# EAGLE schematic OLED (EAGLE 7.1.0)
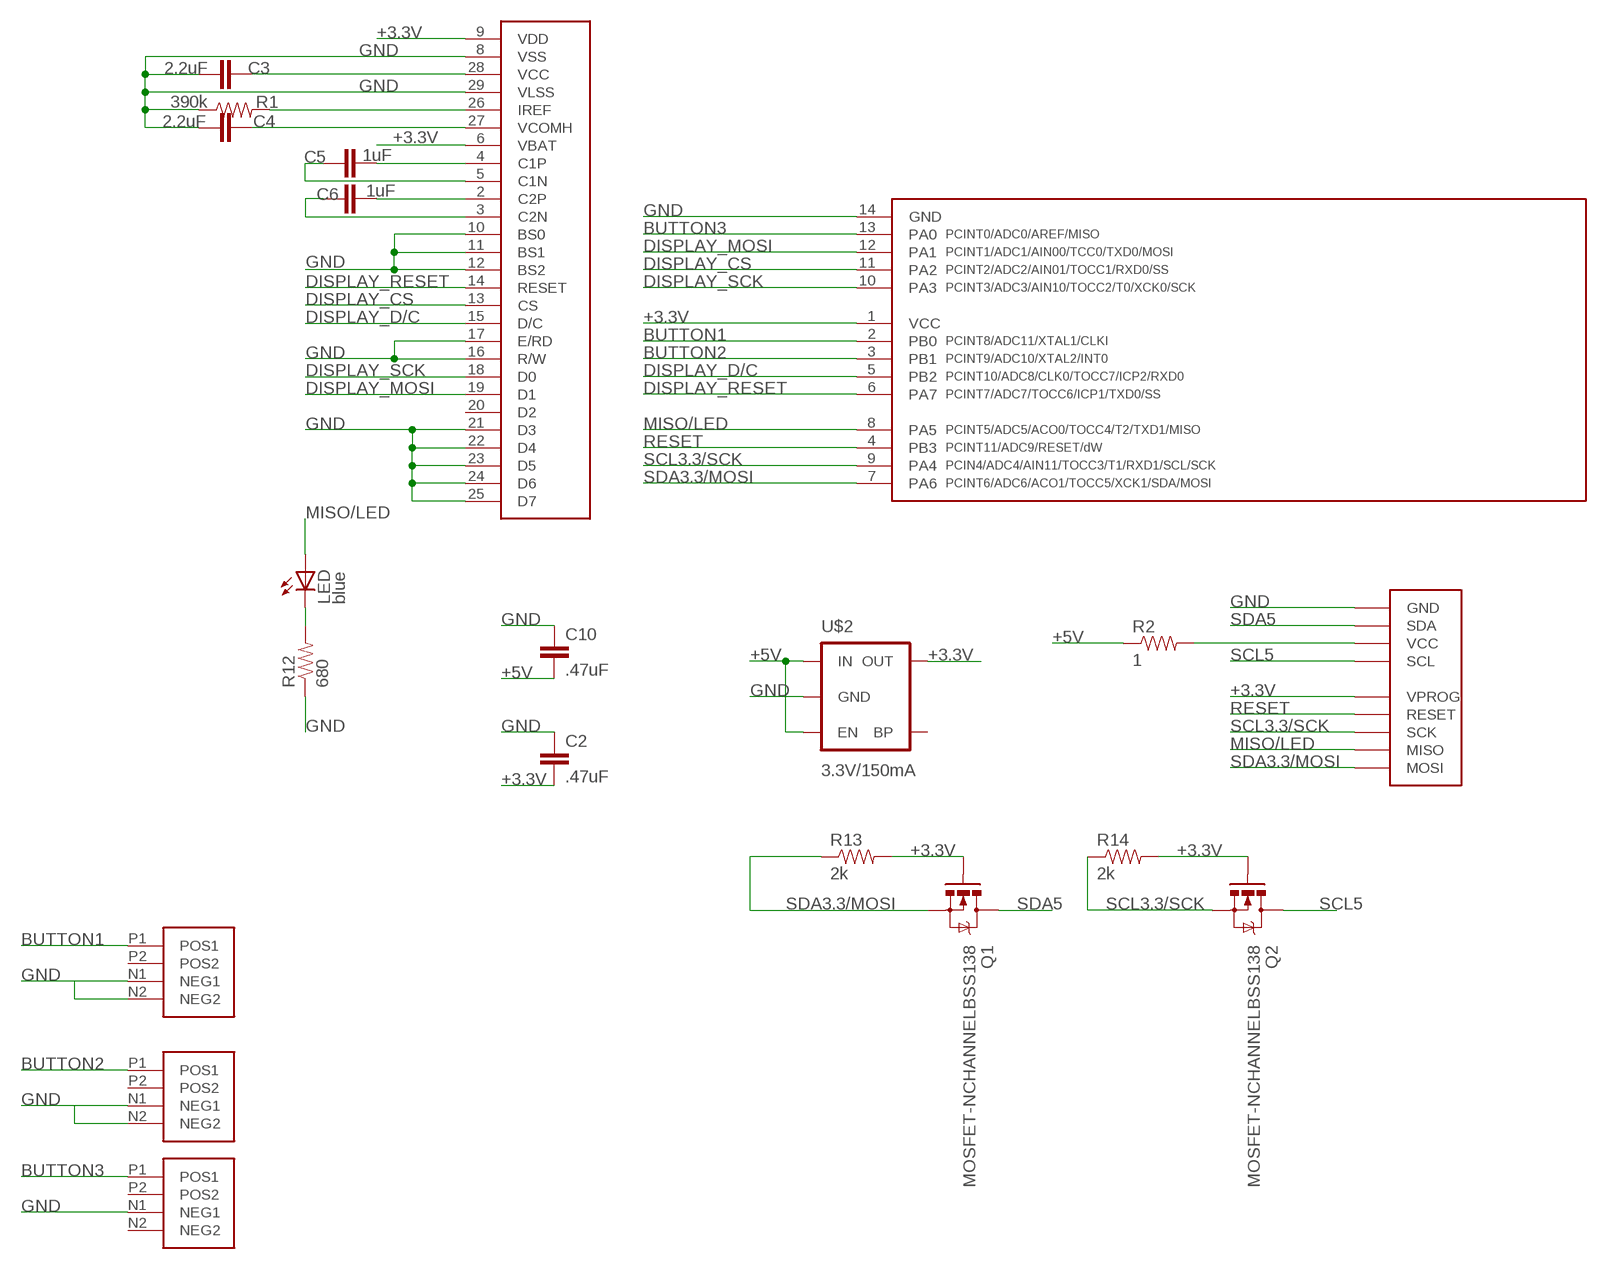
[diagram p0: schematic, sheet 1]

## Parts
C2  .47uF  CAP0805  [0805]
C3  2.2uF  CAP0805  [0805]
C4  2.2uF  CAP0805  [0805]
C5  1uF  CAP0805  [0805]
C6  1uF  CAP0805  [0805]
C10  .47uF  CAP0805  [0805]
LED  blue  LEDCHIPLED_1206  [CHIPLED_1206]
Q1  MOSFET-NCHANNELBSS138  [SOT23]
Q2  MOSFET-NCHANNELBSS138  [SOT23]
R1  390k  RESISTOR0603  [0603-RES]
R2  1  RESISTOR0805-RES  [0805]
R12  680  RESISTOR0805-RES  [0805]
R13  2k  RESISTOR0805-RES  [0805]
R14  2k  RESISTOR0805-RES  [0805]
U$1  OLEDREVERSE  [FPC-30-REVERSE]
U$2  3.3V/150mA  V_REG_MIC52053.3V  [SOT23-5]
U$3  TINY841  [SOIC14]
U$4  FOOTPRINTFOOTPRINT-2  [FOOTPRINT2]
U$5  TACT-SWITCHKMR2  [TACT-SWITCH-SMALL]
U$6  TACT-SWITCHKMR2  [TACT-SWITCH-SMALL]
U$7  TACT-SWITCHKMR2  [TACT-SWITCH-SMALL]

## Nets
+3.3V: C2.2 Q1.1(G) Q2.1(G) R13.2 R14.2 U$1.6(VBAT) U$1.9(VDD) U$2.5(OUT) U$3.1(VCC) U$4.PROG0(VPROG)
+5V: C10.2 R2.1 U$2.1(IN) U$2.3(EN)
BUTTON1: U$3.2(PB0) U$5.P1(POS1)
BUTTON2: U$3.3(PB1) U$6.P1(POS1)
BUTTON3: U$3.13(PA0) U$7.P1(POS1)
DISPLAY_CS: U$1.13(CS) U$3.11(PA2)
DISPLAY_D/C: U$1.15(D/C) U$3.5(PB2)
DISPLAY_MOSI: U$1.19(D1) U$3.12(PA1)
DISPLAY_RESET: U$1.14(RESET) U$3.6(PA7)
DISPLAY_SCK: U$1.18(D0) U$3.10(PA3)
GND: C2.1 C3.2 C4.2 C10.1 R1.1 R12.1 U$1.8(VSS) U$1.10(BS0) U$1.11(BS1) U$1.12(BS2) U$1.16(R/W) U$1.17(E/RD) U$1.21(D3) U$1.22(D4) U$1.23(D5) U$1.24(D6) U$1.25(D7) U$1.29(VLSS) U$2.2(GND) U$3.14(GND) U$4.BUS0(GND) U$5.N1(NEG1) U$5.N2(NEG2) U$6.N1(NEG1) U$6.N2(NEG2) U$7.N1(NEG1)
MISO/LED: LED.A U$3.8(PA5) U$4.PROG3(MISO)
N$2: R1.2 U$1.26(IREF)
N$3: R2.2 U$4.BUS2(VCC)
N$4: C3.1 U$1.28(VCC)
N$6: C4.1 U$1.27(VCOMH)
N$7: LED.C R12.2
N$9: C5.2 U$1.4(C1P)
N$10: C6.2 U$1.2(C2P)
N$11: C5.1 U$1.5(C1N)
N$12: C6.1 U$1.3(C2N)
RESET: U$3.4(PB3) U$4.PROG1(RESET)
SCL3.3/SCK: Q2.2(S) R14.1 U$3.9(PA4) U$4.PROG2(SCK)
SCL5: Q2.3(D) U$4.BUS3(SCL)
SDA3.3/MOSI: Q1.2(S) R13.1 U$3.7(PA6) U$4.PROG4(MOSI)
SDA5: Q1.3(D) U$4.BUS1(SDA)
Unconnected: U$1.20(D2) U$2.4(BP) U$5.P2(POS2) U$6.P2(POS2) U$7.N2(NEG2) U$7.P2(POS2)

## Library data of the parts
C2-C6 C10 = SparkFun-Capacitors:CAP: Capacitor Standard 0603 ceramic capacitor, and 0.1" leaded capacitor.
LED = led:LED: LED OSRAM: - CHIPLED LG R971, LG N971, LY N971, LG Q971, LY Q971, LO R971, LY R971 LH N974, LH R974 LS Q976, LO Q976, LY Q976 LO Q996 - Hyper CHIPLED LW Q18S LB Q993, LB Q99A, LB R99A - SideLED LS A670, LO A670, LY A670, LG A670, LP A670 LB A673, LV A673, LT A673, LW A673 LH A674 LY A675 LS A676, LA A676, LO A676, LY A676, LW A676 LS A679, LY A679, LG A679 - Hyper Micro SIDELED® LS Y876, LA Y876, LO Y876, LY Y876 LT Y87S - SmartLED LW L88C, LW L88S LB L89C, LB L89S, LG L890 LS L89K, LO L89K, LY L89K LS L896, LA L896, LO L896, LY L896 - TOPLED LS T670, LO T670, LY T670, LG T670, LP T670 LSG T670, LSP T670, LSY T670, LOP T670, LYG T670 LG T671, LOG T671, LSG T671 LB T673, LV T673, LT T673, LW T673 LH T674 LS T676, LA T676, LO T676, LY T676, LB T676, LH T676, LSB T676, LW T676 LB T67C, LV T67C, LT T67C, LS T67K, LO T67K, LY T67K, LW E67C LS E67B, LA E67B, LO E67B, LY E67B, LB E67C, LV E67C, LT E67C LW T67C LS T679, LY T679, LG T679 LS T770, LO T770, LY T770, LG T770, LP T770 LB T773, LV T773, LT T773, LW T773 LH T774 LS E675, LA E675, LY E675, LS T675 LS T776, LA T776, LO T776, LY T776, LB T776 LHGB T686 LT T68C, LB T68C - Hyper Mini TOPLED® LB M676 - Mini TOPLED Santana® LG M470 LS M47K, LO M47K, LY M47K Source: http://www.osram.convergy.de LUXEON: - LUMILED® LXK2-PW12-R00, LXK2-PW12-S00, LXK2-PW14-U00, LXK2-PW14-V00 LXK2-PM12-R00, LXK2-PM12-S00, LXK2-PM14-U00 LXK2-PE12-Q00, LXK2-PE12-R00, LXK2-PE12-S00, LXK2-PE14-T00, LXK2-PE14-U00 LXK2-PB12-K00, LXK2-PB12-L00, LXK2-PB12-M00, LXK2-PB14-N00, LXK2-PB14-P00, LXK2-PB14-Q00 LXK2-PR12-L00, LXK2-PR12-M00, LXK2-PR14-Q00, LXK2-PR14-R00 LXK2-PD12-Q00, LXK2-PD12-R00, LXK2-PD12-S00 LXK2-PH12-R00, LXK2-PH12-S00 LXK2-PL12-P00, LXK2-PL12-Q00, LXK2-PL12-R00 Source: www.luxeon.com KINGBRIGHT: KA-3528ASYC Source: www.kingbright.com
Q1 Q2 = SparkFun-DiscreteSemi:MOSFET-NCHANNEL: Common NMOSFET Parts MFG P/N Store ID Prod ID FDD8780 TRANS-09984 SI7820DN TRANS-11055 FDS6630A IC-08089 2N7002PW TRANS-11151 FQP30N06L COM-10213 TRANS-10060 BSS123LT1G TRANS-08345 BSS138 TRANS-00830 BS170 2N7000; PROD_ID: TRANS-00830
R1 = SparkFun-Resistors:RESISTOR: Resistor Basic schematic elements and footprints for 0603, 1206, and PTH resistors.
R2 R12-R14 = SparkFun-Passives:RESISTOR: Resistor Basic schematic elements and footprints for 0603, 1206, and PTH resistors.
U$1 = IntegerLabs:OLED
U$2 = SparkFun-PowerIC:V_REG_MIC5205: V_REG MIC5219 Standard 3.3V and 5V 150mA LDO voltage regulator in SOT-23 layout. Micrel part MIC5205. BP (by-pass) pin is used to lower output noise with 470pF cap, may be left open.; PROD_ID: VREG-00822
U$3 = IntegerLabs:TINY841
U$4 = IntegerLabs:FOOTPRINT
U$5-U$7 = IntegerLabs:TACT-SWITCH